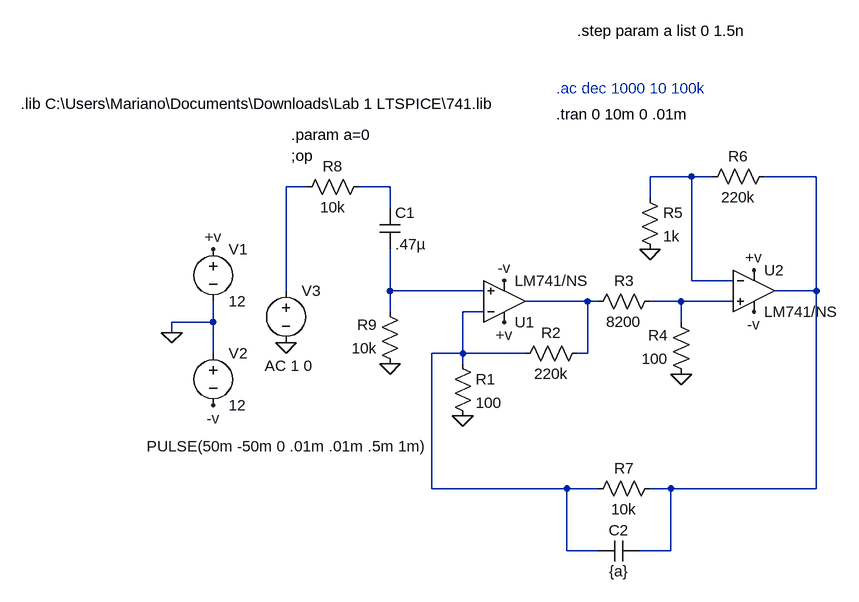
[diagram p0: schematic lab1_1.asc]
lab1_1.asc, the LTspice schematic file:
Version 4
SHEET 1 880 680
WIRE 384 -32 320 -32
WIRE 416 -32 384 -32
WIRE 576 -32 496 -32
WIRE -208 -16 -240 -16
WIRE -80 -16 -128 -16
WIRE 320 0 320 -32
WIRE -80 16 -80 -16
WIRE 384 128 384 -32
WIRE 448 128 384 128
WIRE -240 144 -240 -16
WIRE -80 144 -80 80
WIRE 64 144 -80 144
WIRE 576 144 576 -32
WIRE 576 144 512 144
WIRE 224 160 128 160
WIRE 240 160 224 160
WIRE 368 160 320 160
WIRE 448 160 368 160
WIRE -80 176 -80 144
WIRE 64 176 32 176
WIRE -352 192 -352 160
WIRE -352 192 -416 192
WIRE 368 192 368 160
WIRE -416 208 -416 192
WIRE -352 240 -352 192
WIRE 32 240 32 176
WIRE 32 240 -16 240
WIRE 128 240 32 240
WIRE 224 240 224 160
WIRE 224 240 208 240
WIRE 32 256 32 240
WIRE -16 448 -16 240
WIRE 192 448 -16 448
WIRE 240 448 192 448
WIRE 352 448 320 448
WIRE 576 448 576 144
WIRE 576 448 352 448
WIRE 192 544 192 448
WIRE 240 544 192 544
WIRE 352 544 352 448
WIRE 352 544 304 544
FLAG -416 208 0
FLAG -352 80 +v
FLAG -352 320 -v
FLAG 96 128 -v
FLAG 480 176 -v
FLAG 96 192 +v
FLAG 480 112 +v
FLAG 32 336 0
FLAG 368 272 0
FLAG 320 80 0
FLAG -240 224 0
FLAG -80 256 0
SYMBOL voltage -352 64 R0
WINDOW 123 0 0 Left 2
WINDOW 39 0 0 Left 2
SYMATTR InstName V1
SYMATTR Value 12
SYMBOL voltage -352 224 R0
WINDOW 123 0 0 Left 2
WINDOW 39 0 0 Left 2
SYMATTR InstName V2
SYMATTR Value 12
SYMBOL OpAmps\\opamp2 96 224 M180
SYMATTR InstName U1
SYMATTR Value LM741/NS
SYMBOL OpAmps\\opamp2 480 80 R0
SYMATTR InstName U2
SYMATTR Value LM741/NS
SYMBOL res 16 240 R0
SYMATTR InstName R1
SYMATTR Value 100
SYMBOL res 224 224 R90
WINDOW 0 0 56 VBottom 2
WINDOW 3 32 56 VTop 2
SYMATTR InstName R2
SYMATTR Value 220k
SYMBOL res 336 144 R90
WINDOW 0 0 56 VBottom 2
WINDOW 3 32 56 VTop 2
SYMATTR InstName R3
SYMATTR Value 8200
SYMBOL res 384 288 R180
WINDOW 0 36 76 Left 2
WINDOW 3 36 40 Left 2
SYMATTR InstName R4
SYMATTR Value 100
SYMBOL res 304 -16 R0
SYMATTR InstName R5
SYMATTR Value 1k
SYMBOL res 512 -48 R90
WINDOW 0 0 56 VBottom 2
WINDOW 3 32 56 VTop 2
SYMATTR InstName R6
SYMATTR Value 220k
SYMBOL res 336 432 R90
WINDOW 0 0 56 VBottom 2
WINDOW 3 32 56 VTop 2
SYMATTR InstName R7
SYMATTR Value 10k
SYMBOL voltage -240 128 R0
WINDOW 3 -214 255 Left 2
WINDOW 123 -33 131 Left 2
WINDOW 39 0 0 Left 0
SYMATTR Value PULSE(50m -50m 0 .01m .01m .5m 1m)
SYMATTR Value2 AC 1 0
SYMATTR InstName V3
SYMBOL res -112 -32 R90
WINDOW 0 0 56 VBottom 2
WINDOW 3 32 56 VTop 2
SYMATTR InstName R8
SYMATTR Value 10k
SYMBOL res -64 272 R180
WINDOW 0 36 76 Left 2
WINDOW 3 36 40 Left 2
SYMATTR InstName R9
SYMATTR Value 10k
SYMBOL cap -96 16 R0
SYMATTR InstName C1
SYMATTR Value .47µ
SYMBOL cap 304 528 R90
WINDOW 0 0 32 VBottom 2
WINDOW 3 32 32 VTop 2
SYMATTR InstName C2
SYMATTR Value {a}
TEXT -648 -144 Left 2 !.lib C:\\Users\\Mariano\\Documents\\Downloads\\Lab 1 LTSPICE\\741.lib
TEXT -232 -96 Left 2 !.param a=0
TEXT -232 -64 Left 2 !;op
TEXT 176 -168 Left 2 ;.ac dec 1000 10 100k
TEXT 176 -128 Left 2 !.tran 0 10m 0 .01m
TEXT 208 -256 Left 2 !.step param a list 0 1.5n

The netlist it stands for:
* lab1_1.asc
V1 +v 0 12
V2 0 -v 12
XU1 N005 N008 +v -v N006 LM741/NS  ; pins In+ In- V+ V- OUT
XU2 N007 N001 +v -v N002 LM741/NS  ; pins In+ In- V+ V- OUT
R1 N008 0 100
R2 N006 N008 220k
R3 N007 N006 8200
R4 0 N007 100
R5 N001 0 1k
R6 N002 N001 220k
R7 N002 N008 10k
V3 N003 0 PULSE(50m -50m 0 .01m .01m .5m 1m) AC 1 0
R8 N004 N003 10k
R9 0 N005 10k
C1 N004 N005 .47µ
C2 N002 N008 {a}
.lib C:\Users\Mariano\Documents\Downloads\Lab 1 LTSPICE\741.lib
.param a=0
;op
* .ac dec 1000 10 100k
.tran 0 10m 0 .01m
.step param a list 0 1.5n
.backanno
.end